# Altium schematic sheet 00-SNESDRONE_Direct_IO_MAIN.SchDoc
size A4
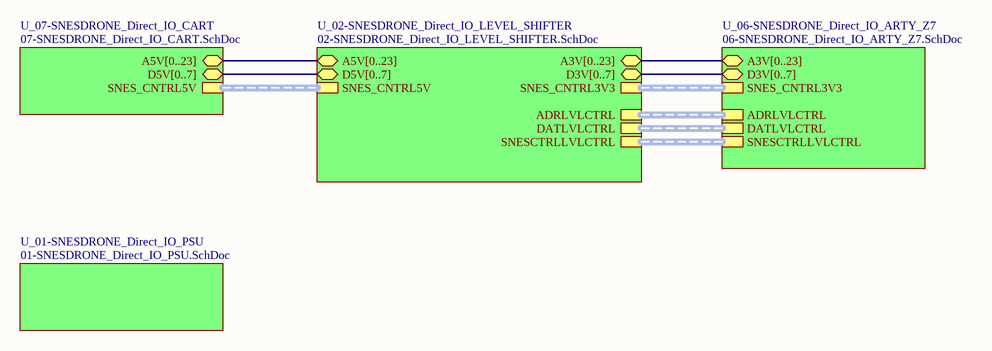
[diagram p0: 00-SNESDRONE_Direct_IO_MAIN.SchDoc]

## Sub-sheets
U_01-SNESDRONE_Direct_IO_PSU = 01-SNESDRONE_Direct_IO_PSU.SchDoc: no entries
U_02-SNESDRONE_Direct_IO_LEVEL_SHIFTER = 02-SNESDRONE_Direct_IO_LEVEL_SHIFTER.SchDoc: A5V[0..23] (bidir), A3V[0..23] (bidir), D5V[0..7] (bidir), D3V[0..7] (bidir), ADRLVLCTRL (harness ADRLVLCTRL), DATLVLCTRL (harness DATLVLCTRL), SNES_CNTRL5V (harness SNES_CNTRL5V), SNES_CNTRL3V3 (harness SNES_CNTRL3V3), SNESCTRLLVLCTRL (harness SNESCTRLLVLCTRL)
U_06-SNESDRONE_Direct_IO_ARTY_Z7 = 06-SNESDRONE_Direct_IO_ARTY_Z7.SchDoc: A3V[0..23] (bidir), D3V[0..7] (bidir), ADRLVLCTRL (harness ADRLVLCTRL), DATLVLCTRL (harness DATLVLCTRL), SNES_CNTRL3V3 (harness SNES_CNTRL3V3), SNESCTRLLVLCTRL (harness SNESCTRLLVLCTRL)
U_07-SNESDRONE_Direct_IO_CART = 07-SNESDRONE_Direct_IO_CART.SchDoc: A5V[0..23] (bidir), D5V[0..7] (bidir), SNES_CNTRL5V (harness SNES_CNTRL5V)

## Buses and harness runs
bus sheet U_02-SNESDRONE_Direct_IO_LEVEL_SHIFTER/A3V[0..23] = sheet U_06-SNESDRONE_Direct_IO_ARTY_Z7/A3V[0..23]
bus sheet U_02-SNESDRONE_Direct_IO_LEVEL_SHIFTER/A5V[0..23] = sheet U_07-SNESDRONE_Direct_IO_CART/A5V[0..23]
bus sheet U_02-SNESDRONE_Direct_IO_LEVEL_SHIFTER/D3V[0..7] = sheet U_06-SNESDRONE_Direct_IO_ARTY_Z7/D3V[0..7]
bus sheet U_02-SNESDRONE_Direct_IO_LEVEL_SHIFTER/D5V[0..7] = sheet U_07-SNESDRONE_Direct_IO_CART/D5V[0..7]
harness sheet U_02-SNESDRONE_Direct_IO_LEVEL_SHIFTER/ADRLVLCTRL = sheet U_06-SNESDRONE_Direct_IO_ARTY_Z7/ADRLVLCTRL
harness sheet U_02-SNESDRONE_Direct_IO_LEVEL_SHIFTER/DATLVLCTRL = sheet U_06-SNESDRONE_Direct_IO_ARTY_Z7/DATLVLCTRL
harness sheet U_02-SNESDRONE_Direct_IO_LEVEL_SHIFTER/SNES_CNTRL3V3 = sheet U_06-SNESDRONE_Direct_IO_ARTY_Z7/SNES_CNTRL3V3
harness sheet U_02-SNESDRONE_Direct_IO_LEVEL_SHIFTER/SNES_CNTRL5V = sheet U_07-SNESDRONE_Direct_IO_CART/SNES_CNTRL5V
harness sheet U_02-SNESDRONE_Direct_IO_LEVEL_SHIFTER/SNESCTRLLVLCTRL = sheet U_06-SNESDRONE_Direct_IO_ARTY_Z7/SNESCTRLLVLCTRL